# Altium schematic sheet SS-12D07-L4-B_2021-01-11.schdoc
size 41 x 32 mm
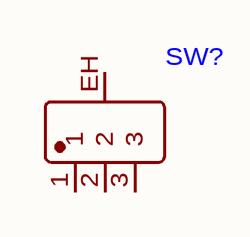
[diagram p0: SS-12D07-L4-B_2021-01-11.schdoc]

## Parts
SW?  (no value)  [SW-TH_SS-12D07-X-X]

## Nets

Not connected (* = marked no-connect by the designer): SW? 1 2 3 EH

## Library data of the parts
SW? = SS-12D07-L4-B